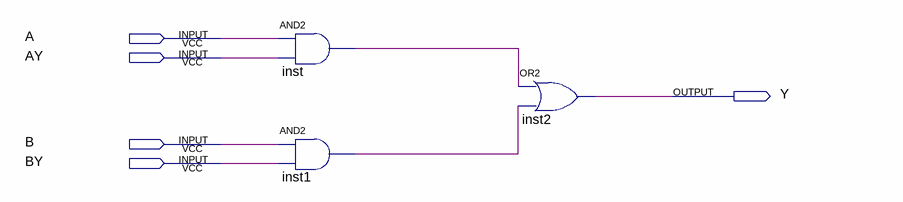
[diagram p0: schematic sheet]
// Quartus schematic MY_DATASELECTOR1.bdf as structural Verilog: 3 symbols, 5 pins
module MY_DATASELECTOR1 (
  input  A,
  input  AY,
  input  B,
  input  BY,
  output Y
);

  wire inst1_out, inst_out;

  and inst (inst_out, A, AY);
  and inst1 (inst1_out, B, BY);
  or inst2 (Y, inst_out, inst1_out);
endmodule
